# Altium schematic sheet Docking.SchDoc
size B
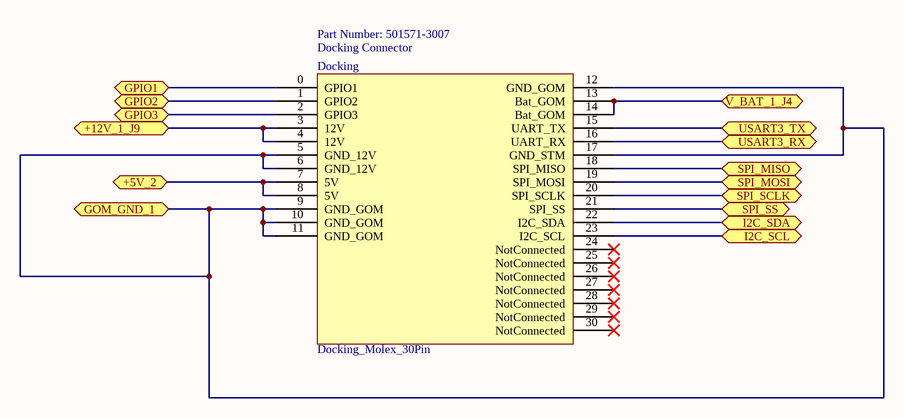
[diagram p0: Docking.SchDoc]

## Parts
Docking  Docking_Molex_30Pin  [Docking_Molex_30Pin]

## Ports
+5V_2 (bidir), +12V_1_J9 (bidir), GOM_GND_1 (bidir), GPIO1 (bidir), GPIO2 (bidir), GPIO3 (bidir), I2C_SCL (bidir), I2C_SDA (bidir), SPI_MISO (bidir), SPI_MOSI (bidir), SPI_SCLK (bidir), SPI_SS (bidir), USART3_RX (bidir), USART3_TX (bidir), V_BAT_1_J4 (bidir)

## Nets
+5V_2: Docking.7(5V) Docking.8(5V) ; port +5V_2
+12V_1_J9: Docking.3(12V) Docking.4(12V) ; port +12V_1_J9
GOM_GND_1: Docking.5(GND_12V) Docking.6(GND_12V) Docking.9(GND_GOM) Docking.10(GND_GOM) Docking.11(GND_GOM) Docking.12(GND_GOM) Docking.17(GND_STM) ; port GOM_GND_1
GPIO1: Docking.0(GPIO1) ; port GPIO1
GPIO2: Docking.1(GPIO2) ; port GPIO2
GPIO3: Docking.2(GPIO3) ; port GPIO3
I2C_SCL: Docking.23(I2C_SCL) ; port I2C_SCL
I2C_SDA: Docking.22(I2C_SDA) ; port I2C_SDA
SPI_MISO: Docking.18(SPI_MISO) ; port SPI_MISO
SPI_MOSI: Docking.19(SPI_MOSI) ; port SPI_MOSI
SPI_SCLK: Docking.20(SPI_SCLK) ; port SPI_SCLK
SPI_SS: Docking.21(SPI_SS) ; port SPI_SS
USART3_RX: Docking.16(UART_RX) ; port USART3_RX
USART3_TX: Docking.15(UART_TX) ; port USART3_TX
V_BAT_1_J4: Docking.13(Bat_GOM) Docking.14(Bat_GOM) ; port V_BAT_1_J4

Not connected (* = marked no-connect by the designer): Docking 24(NotConnected)* 25(NotConnected)* 26(NotConnected)* 27(NotConnected)* 28(NotConnected)* 29(NotConnected)* 30(NotConnected)*

## Notes on the sheet
- (near Docking) Part Number: 501571-3007
- (near Docking) Docking Connector

## Library data of the parts
Docking = Docking_Molex_30Pin: 24 Pin Connector; pin to pad: 0>A1 1>A2 2>A3 3>A4 4>A5 5>A6 6>A7 7>A8 8>A9 9>A10 10>A11 11>A12 12>A13 13>A14 14>A15 15>A16 16>A17 17>A18 18>A19 19>A20 20>A21 21>A22 22>A23 23>A24 24>A25